# Altium schematic sheet PowerSupply.SchDoc: Power Supply
size A4; Engineer: David; DocumentNumber: 2; SheetNumber: 2; SheetTotal: 9; Project: SmartCanton Dev Box; Labo: LSN; PageSetup: Record=PageOptions|CenterHorizontal=True|CenterVertical=True|PrintScale=0.97|XCorrection=1.00|YCorrection=1.00|PrintKind=1|BorderSize=5000000|LeftOffset=0|BottomOffset=0|Orientation=2|PaperLength=1000|PaperWidth=1000|Scale=100|PaperSource=7|PrintQuality=-3|MediaType=1|DitherType=10|PrintScaleMode=1|PaperKind=A4 (210 x 297 mm)|PaperIndex=9; ProjectName: SmartCanton Dev Box
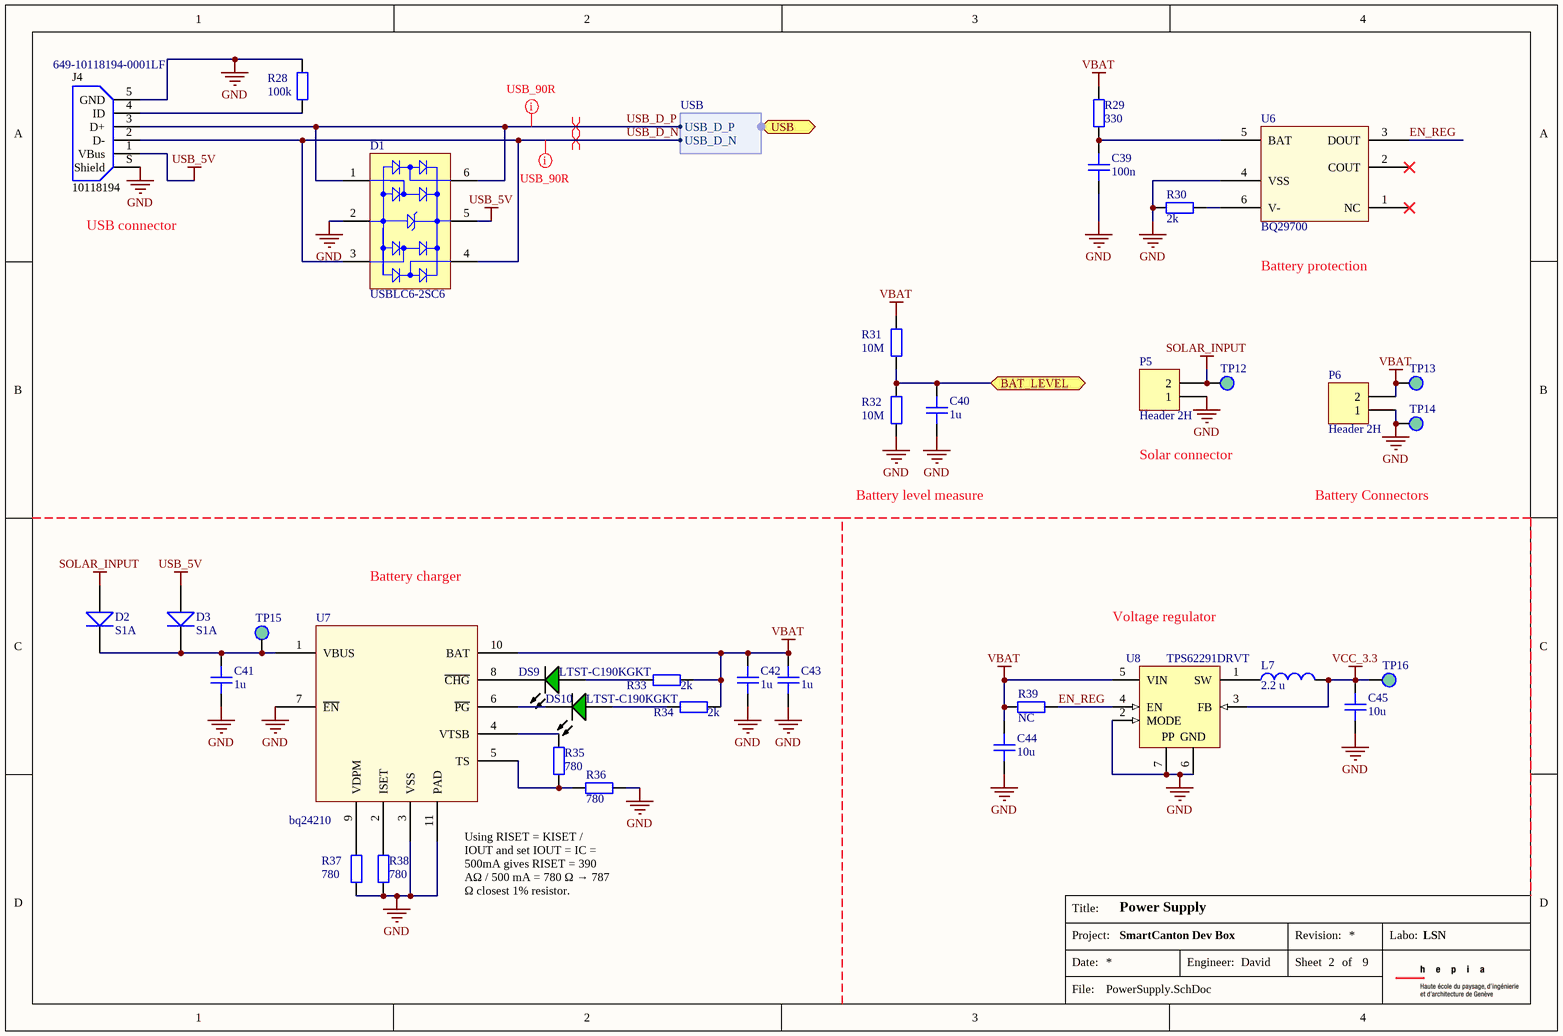
[diagram p0: PowerSupply.SchDoc]

## Parts
C39  100n  [CAPC1608X08]
C40  1u  [CAPC1608X08]
C41  1u  [CAPC1608X08]
C42  1u  [CAPC1608X08]
C43  1u  [CAPC1608X08]
C44  10u  [CAPC2012X14]
C45  10u  [CAPC2012X14]
D1  USBLC6-2SC6  [STM-SOT23-6L_V]
D2  S1A  [DO-214AC]
D3  S1A  [DO-214AC]
DS9  LTST-C190KGKT  [LITE-ON-LTST-C190GKT-2_V]
DS10  LTST-C190KGKT  [LITE-ON-LTST-C190GKT-2_V]
J4  10118194  Supplier Part Number 1: 649-10118194-0001LF  [10118194-0001LF]
L7  2.2 u  [TDK-IND0805-125_V]
P5  Header 2H  [HDR1X2H]
P6  Header 2H  [HDR1X2H]
R28  100k  [RESC1608X06]
R29  330  [RESC1608X06]
R30  2k  [RESC1608X06]
R31  10M  [RESC1608X06]
R32  10M  [RESC1608X06]
R33  2k  [RESC1608X06]
R34  2k  [RESC1608X06]
R35  780  [RESC1608X06]
R36  780  [RESC1608X06]
R37  780  [RESC1608X06]
R38  780  [RESC1608X06]
R39  NC  [RESC1608X06]
TP12  5015  [5015]  (value not drawn)
TP13  5015  [5015]  (value not drawn)
TP14  5015  [5015]  (value not drawn)
TP15  5015  [5015]  (value not drawn)
TP16  5015  [5015]  (value not drawn)
U6  BQ29700  [SON50P150X75-6M]
U7  bq24210  [WSON50P200X300X80-11N]
U8  TPS62291DRVT  [DRV0006A_V]

## Ports
BAT_LEVEL, USB (harness USB)

## Harnesses
USB: USB_D_P, USB_D_N

## Nets
GND: C39.1 C40.1 C41.1 C42.1 C43.1 C44.2 C45.2 D1.2(GND) J4.5(GND) J4.S(Shield) P5.1 P6.1 R28.2 R30.1 R32.1 R36.1 R37.1 R38.1 TP14.1(TP) U6.4(VSS) U7.3(VSS) U7.7(~{EN}) U7.11(PAD) U8.2(MODE) U8.6(GND) U8.7(EP)
SOLAR_INPUT: D2.A P5.2 TP12.1(TP)
USB_5V: D1.5(VBUS) D3.A J4.1(VBus)
VBAT: C42.2 C43.2 C44.1 P6.2 R29.2 R31.2 R33.1 R34.1 R39.2 TP13.1(TP) U7.10(BAT) U8.5(VIN)
VCC_3.3: C45.1 L7.2 TP16.1(TP) U8.3(FB)
BAT_LEVEL: C40.2 R31.1 R32.2 ; port BAT_LEVEL
EN_REG: R39.1 U6.3(DOUT) U8.4(EN)
USB_D_N: D1.3(I/O_2) D1.4(I/O_3) J4.2(D-) ; port USB.USB_D_N
USB_D_P: D1.1(I/O_1) D1.6(I/O_4) J4.3(D+) ; port USB.USB_D_P
NetC39_2: C39.2 R29.1 U6.5(BAT)
NetC41_2: C41.2 D2.K D3.K TP15.1(TP) U7.1(VBUS)
NetDS9_1: DS9.1(A) R33.2
NetDS9_2: DS9.2(K) U7.8(~{CHG})
NetDS10_1: DS10.1(A) R34.2
NetDS10_2: DS10.2(K) U7.6(~{PG})
NetJ4_4: J4.4(ID) R28.1
NetL7_1: L7.1 U8.1(SW)
NetR30_2: R30.2 U6.6(V-)
NetR35_1: R35.1 R36.2 U7.5(TS)
NetR35_2: R35.2 U7.4(VTSB)
NetR37_2: R37.2 U7.9(VDPM)
NetR38_2: R38.2 U7.2(ISET)

Not connected (* = marked no-connect by the designer): U6 1(NC)* 2(COUT)*

## Layout directives
differential pair; net class USB_90R: USB_D_N, USB_D_P
rule Impedance Constraint [Min = 90.00    Max = 90.00    ]; net class USB_90R: USB_D_N, USB_D_P

## Notes on the sheet
- (near J4) USB connector
- (near U6) Battery protection
- Battery level measure
- Solar connector
- Battery Connectors
- Battery charger
- Voltage regulator
- Using RISET = KISET / IOUT and set IOUT = IC = 500mA gives RISET = 390 AΩ / 500 mA = 780 Ω → 787 Ω closest 1% resistor.
- Title:
- Date:
- Project:
- Engineer:
- Revision:
- Sheet
- of
- Labo:
- File:
- (in symbol CMP-00017-A.1) PP

## Library data of the parts
C39-C43 = CMP-001-0010-A.3: MLCC Capacitor 1608; RevisionId: A.2; AccessRights: 2147483647; Folder: LSN\Components\Passifs\Condensateurs\; ContentType: Component; LifeCycleStateGUID: 706004B5-C76E-482E-903B-BA0E4FAE086A; ReleaseDate: 31/10/2016 02:21:03 PM; ContentTypeGUID: CB3C11C4-E317-11DF-B822-12313F0024A2; ItemGUID: 6B05C9AF-D3C2-4723-98C2-0E51694C471A; ItemHRID: CMP-001-0010; FolderGUID: 9DA6C5B0-B134-4C0D-99DA-A840DED25FBD; LifeCycle: New From Design; ComponentType: Capacitor
  C39: Value: 100n
  C40-C43: Value: 1u
C44 C45 = CMP-001-0011-A.3: MLCC Capacitor 2012; RevisionId: A.2; AccessRights: 2147483647; Folder: LSN\Components\Passifs\Condensateurs\; ContentType: Component; LifeCycleStateGUID: 706004B5-C76E-482E-903B-BA0E4FAE086A; ReleaseDate: 31/10/2016 02:37:45 PM; ContentTypeGUID: CB3C11C4-E317-11DF-B822-12313F0024A2; ItemGUID: A3557974-B927-469A-A63C-1E583F58844C; ItemHRID: CMP-001-0011; FolderGUID: 9DA6C5B0-B134-4C0D-99DA-A840DED25FBD; LifeCycle: New From Design; ComponentType: Capacitor; Value: 10u
D1 = CMP-2000-05378-1: Very low capacitance ESD protection, 3.5 pF, -40 to 125 degC, 6-Pin SOT23, RoHS, Tape and Reel; Manufacturer: STMicroelectronics; Polarity: Uni-Directional; Clamping Voltage: 17V; Rad Hardened: No; Product Height (mm): 1.3mm; Leakage Current (Max): 0.15uA; Product Length (mm): 3.05mm; Number of Elements: 1; Peak Pulse Current: 5A; Configuration: Dual; Reverse Breakdown Voltage: 6V; Working Voltage (Max): 5V; Capacitance Value: 3.5pF; Suppressor Type: DiodeArrays; Product Depth (mm): 1.75mm; Test Current (It): 1mA; Package / Case: SOT-23; Operating Temperature Max Deg. C: 125C; Package Description: 6-Pin Small Outline Transistor, Body 2.925 x 1.625 mm, Pitch 0.95 mm; Package Reference: SOT23-6L; Datasheet Version: Rev. 5, 10/2011; Operating Temperature Min Deg. C: -40C; Mounting Style: SurfaceMount; Direction Type: Uni-Directional; Mounting: SurfaceMount; Pin Count: 6; Leakage Current: 0.15uA; Packaging: TapeandReel; Operating Temperature Classification: Automotive; Clamping Voltage (Max): 17V; Manufacturer URL: http://www.st.com/; Reverse Stand-off Voltage: 5V; Datasheet URL: http://www.st.com/st-web-ui/static/active/en/resource/technical/document/datasheet/CD00050750.pdf; Working Voltage: 5V; Operating Temp Range: -40Cto125C; Supplier 1: Mouser; Supplier Part Number 1: 511-USBLC6-2SC6
D2 D3 = CMP-001-0034-A.1: General-Purpose Rectifier, Vrrm = 50V
DS9 DS10 = CMP-00026-A.1: LED Uni-Color Green, 75 mW, 5 V, -30 to 85 degC, 2-Pin SMD, RoHS, Tape and Reel; Manufacturer: Lite-On; Reverse Voltage: 5V; Product Depth (mm): 0.8mm; Forward Voltage: 2.4V; Rad Hardened: No; High Brightness: Yes; Forward Current: 30mA; Viewing Angle: 130deg; Test Current (It): 20mA; Emitting Color: YellowGreen; Number of Elements: 1; Luminous Intensity: 35mcd; Chip Material: AlGaInP; Shape Type: Rectangular; Dominant Wave Length: 571nm; Peak Wavelength: 574nm; Main Category: ChipLED; DELETED: Compliant; Product Length (mm): 1.6mm; Power Dissipation: 75W; Package Reference: C190KGKT; Mounting: SurfaceMount; Package Description: 2-Pin Surface Mount Device, Body 1.6 x 0.8 mm; Datasheet Version: Jul-15; Operating Temperature Classification: Industrial; Packaging: TapeandReel; Lens Dimensions: 1.1X0.8X0.52mm; Type: Uni-Color; Manufacturer URL: http://www.us.liteon.com/; Datasheet URL: http://datasheet.octopart.com/LTST-C190KGKT-Lite-On-datasheet-43775815.pdf; Product Height (mm): 0.8mm; Operating Temp Range: -55Cto85C; Pin Count: 2; Package Type: ChipLed; Lum Intensity: 35mcd; Supplier 1: Mouser; Supplier Part Number 1: 859-LTST-C190KGKT
J4 = CMP-001-0075-A.1: Supplier 1: Mouser
L7 = CMP-0266-00001-1: Multilayer Inductor, 2.2 uH, ±20%, 300 mOhm, 50MHz, 0805(2012); PartNumber: MLZ2012N100LT; DC Resistance: 0.3 Ohm; PackageReference: IND0805-125; ComponentLink1URL: http://www.global.tdk.com/; DatasheetVersion: 05/2013; ComponentLink2Description: Datasheet; ComponentLink1Description: Manufacturer URL; Mounting Technology: Suface Mount; ComponentLink2URL: http://www.tdk.co.jp/tcfx01/c533_mlz.pdf; PackageDescription: 2-Pin SMT Inductor, 2 x 1.25 mm Body; Supplier 1: Mouser; Supplier Part Number 1: 810-MLZ2012N2R2LT000
P5 P6 = Header 2H: Header, 2-Pin, Right Angle; LatestRevisionDate: 17-Jul-2002; LatestRevisionNote: Re-released for DXP Platform.; Publisher: Altium Limited
  P5: Supplier 1: Mouser; Supplier Part Number 1: 538-22-05-3021
  P6: Supplier 1: Digi-Key; Supplier Part Number 1: WM4300-ND
R28-R39 = CMP-001-0005-A.4: 1608 resistor
  R28: Value: 100k
  R29: Value: 330
  R30 R33 R34: Value: 2k
  R31 R32: Value: 10M
  R35-R38: Value: 780
  R39: Value: NC
TP12-TP16 = CMP-001-0108-A.3: Circuit Board Hardware - PCB MINI SMT TEST POINT
U6 = CMP-001-0114-A.2: Supplier 1: Mouser; Supplier Part Number 1: 595-BQ29700DSET
U7 = CMP-001-0111-A.1: 800-mA, Single-Input, Single-Cell Li-Ion Battery Solar Charger; Supplier 1: Mouser; Supplier Part Number 1: 595-BQ24210DQCT
U8 = CMP-00017-A.1: Buck Step Down Regulator with 2.3 to 6 V Input and 3.3 V Output, -40 to 85 degC, 6-Pin SON (DRV), Green (RoHS & no Sb/Br); Manufacturer: Texas Instruments; Preset Vout(V): 3.3; Switch Current Limit(Typ)(A): 1.4; Synchronous Rectification: TRUE; Duty Cycle(Max)(%): 100; Iout(Max)(A): 1; Vin(Max)(V): 6; Iq(Typ)(mA): 0.015; Rating: Catalog; SubFamily: Step-Down Regulator; Vin(Min)(V): 2.3; PartNumber: TPS62291DRVT; Mounting Technology: Surface Mount; ComponentLink2Description: Package Specification; Topology: Buck; ComponentLink1Description: Datasheet; Eco-Plan: Green (RoHS & no Sb/Br); Regulated Outputs(#): 1; ComponentLink1URL: http://www.ti.com/general/docs/lit/getliterature.tsp?genericPartNumber=TPS62291&fileType=pdf; DatasheetVersion: SLVS764C; ComponentLink3Description: URL Link1; Vout(Min)(V): 3.3; Vout(Max)(V): 3.3; PackageDescription: 6-Pin Plastic Small Outline No-Lead, 2 x 2 x 0.8 mm Body, 0.65 mm Pitch, Exposed Pad; ComponentLink2URL: http://www.ti.com/litv/pdf/mpds216d; PackageReference: DRV0006A; ComponentLink3URL: Samples URL:http://www.ti.com/product/tps62291#samples; PackageVersion: revE, Oct-2010; Supplier 1: Mouser; Supplier Part Number 1: 595-TPS62291DRVT